# Altium schematic sheet emmc.schdoc: EMMC
size A4; Date: 10.25.2025; CheckedBy: BCY; DrawnBy: miaow; DocumentNumber: 4; Revision: v1.0.0; SheetNumber: 4; SheetTotal: 14; BoardType: MAIN_PCB; Desc: EMMC for mcu
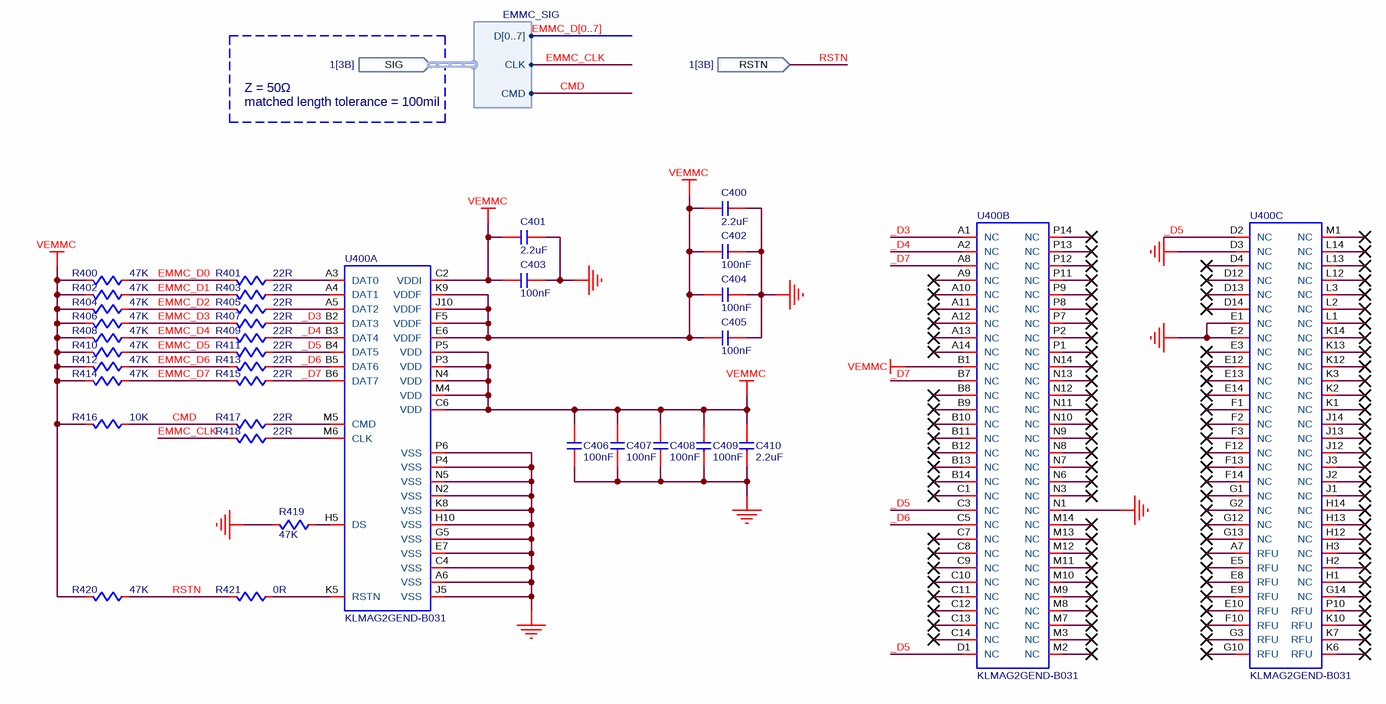
[diagram p0: emmc.schdoc]

## Parts
C400  value 2.2uF  [C0402]  (hidden comment: C-NOMO)
C401  value 2.2uF  [C0402]  (hidden comment: C-NOMO)
C402  value 100nF  [C0402]  (hidden comment: C-NOMO)
C403  value 100nF  [C0402]  (hidden comment: C-NOMO)
C404  value 100nF  [C0402]  (hidden comment: C-NOMO)
C405  value 100nF  [C0402]  (hidden comment: C-NOMO)
C406  value 100nF  [C0402]  (hidden comment: C-NOMO)
C407  value 100nF  [C0402]  (hidden comment: C-NOMO)
C408  value 100nF  [C0402]  (hidden comment: C-NOMO)
C409  value 100nF  [C0402]  (hidden comment: C-NOMO)
C410  value 2.2uF  [C0402]  (hidden comment: C-NOMO)
R400  value 47K  [R0402]  (hidden comment: R)
R401  value 22R  [R0402]  (hidden comment: R)
R402  value 47K  [R0402]  (hidden comment: R)
R403  value 22R  [R0402]  (hidden comment: R)
R404  value 47K  [R0402]  (hidden comment: R)
R405  value 22R  [R0402]  (hidden comment: R)
R406  value 47K  [R0402]  (hidden comment: R)
R407  value 22R  [R0402]  (hidden comment: R)
R408  value 47K  [R0402]  (hidden comment: R)
R409  value 22R  [R0402]  (hidden comment: R)
R410  value 47K  [R0402]  (hidden comment: R)
R411  value 22R  [R0402]  (hidden comment: R)
R412  value 47K  [R0402]  (hidden comment: R)
R413  value 22R  [R0402]  (hidden comment: R)
R414  value 47K  [R0402]  (hidden comment: R)
R415  value 22R  [R0402]  (hidden comment: R)
R416  value 10K  [R0402]  (hidden comment: R)
R417  value 22R  [R0402]  (hidden comment: R)
R418  value 22R  [R0402]  (hidden comment: R)
R419  value 47K  [R0402]  (hidden comment: R)
R420  value 47K  [R0402]  (hidden comment: R)
R421  value 0R  [R0402]  (hidden comment: R)
U400  KLMAG2GEND-B031  [KLMAG2GEND-B031]  (parts A,B,C of 3)

## Ports
RSTN (in, see 1[3B]), SIG (in, harness EMMC_SIG, see 1[3B])

## Harnesses
EMMC_SIG: D[0..7], CLK, CMD

## Nets
GND: C400.1 C401.1 C402.1 C403.1 C404.1 C405.1 C406.1 C407.1 C408.1 C409.1 C410.1 R419.1 U400.A6(VSS) U400.C4(VSS) U400.D3(NC) U400.E1(NC) U400.E2(NC) U400.E7(VSS) U400.G5(VSS) U400.H10(VSS) U400.J5(VSS) U400.K8(VSS) U400.N1(NC) U400.N2(VSS) U400.N5(VSS) U400.P4(VSS) U400.P6(VSS)
VEMMC: C400.2 C401.2 C402.2 C403.2 C404.2 C405.2 C406.2 C407.2 C408.2 C409.2 C410.2 R400.1 R402.1 R404.1 R406.1 R408.1 R410.1 R412.1 R414.1 R416.1 R420.1 U400.B1(NC) U400.C2(VDDI) U400.C6(VDD) U400.E6(VDDF) U400.F5(VDDF) U400.J10(VDDF) U400.K9(VDDF) U400.M4(VDD) U400.N4(VDD) U400.P3(VDD) U400.P5(VDD)
_D3: R407.2 U400.A1(NC) U400.B2(DAT3)
_D4: R409.2 U400.A2(NC) U400.B3(DAT4)
_D5: R411.2 U400.B4(DAT5) U400.C3(NC) U400.D1(NC) U400.D2(NC)
_D6: R413.2 U400.B5(DAT6) U400.C5(NC)
_D7: R415.2 U400.A8(NC) U400.B6(DAT7) U400.B7(NC)
CMD: R416.2 R417.1 ; port SIG.CMD
EMMC_CLK: R418.1 ; port SIG.CLK
EMMC_D0: R400.2 R401.1
EMMC_D1: R402.2 R403.1
EMMC_D2: R404.2 R405.1
EMMC_D3: R406.2 R407.1
EMMC_D4: R408.2 R409.1
EMMC_D5: R410.2 R411.1
EMMC_D6: R412.2 R413.1
EMMC_D7: R414.2 R415.1
RSTN: R420.2 R421.1 ; port RSTN
NetR401_2: R401.2 U400.A3(DAT0)
NetR403_2: R403.2 U400.A4(DAT1)
NetR405_2: R405.2 U400.A5(DAT2)
NetR417_2: R417.2 U400.M5(CMD)
NetR418_2: R418.2 U400.M6(CLK)
NetR419_2: R419.2 U400.H5(DS)
NetR421_2: R421.2 U400.K5(RSTN)

Not connected (* = marked no-connect by the designer): U400 A7(RFU)* A9(NC)* A10(NC)* A11(NC)* A12(NC)* A13(NC)* A14(NC)* B8(NC)* B9(NC)* B10(NC)* B11(NC)* B12(NC)* B13(NC)* B14(NC)* C1(NC)* C7(NC)* C8(NC)* C9(NC)* C10(NC)* C11(NC)* C12(NC)* C13(NC)* C14(NC)* D4(NC)* D12(NC)* D13(NC)* D14(NC)* E3(NC)* E5(RFU)* E8(RFU)* E9(RFU)* E10(RFU)* E12(NC)* E13(NC)* E14(NC)* F1(NC)* F2(NC)* F3(NC)* F10(RFU)* F12(NC)* F13(NC)* F14(NC)* G1(NC)* G2(NC)* G3(RFU)* G10(RFU)* G12(NC)* G13(NC)* G14(NC)* H1(NC)* H2(NC)* H3(NC)* H12(NC)* H13(NC)* H14(NC)* J1(NC)* J2(NC)* J3(NC)* J12(NC)* J13(NC)* J14(NC)* K1(NC)* K2(NC)* K3(NC)* K6(RFU)* K7(RFU)* K10(RFU)* K12(NC)* K13(NC)* K14(NC)* L1(NC)* L2(NC)* L3(NC)* L12(NC)* L13(NC)* L14(NC)* M1(NC)* M2(NC)* M3(NC)* M7(NC)* M8(NC)* M9(NC)* M10(NC)* M11(NC)* M12(NC)* M13(NC)* M14(NC)* N3(NC)* N6(NC)* N7(NC)* N8(NC)* N9(NC)* N10(NC)* N11(NC)* N12(NC)* N13(NC)* N14(NC)* P1(NC)* P2(NC)* P7(NC)* P8(NC)* P9(NC)* P10(RFU)* P11(NC)* P12(NC)* P13(NC)* P14(NC)*

## Buses and harness runs
bus EMMC_D[0..7]

## Notes on the sheet
- Z = 50Ω
  matched length tolerance = 100mil
- DRAWN
- CHECKED
- DRAWNBY
- SHEETS
- SHEETS_NO

## Library data of the parts
C400-C410 = C-NOMO: voltage: 25V; precision: 5%
R400-R421 = R: precision: 1%
U400 = KLMAG2GEND-B031: EMMC; Supplier 1: Win Source; Supplier Part Number 1: 826874-KLMAG2GEND-B031